# EAGLE design Game_Board (EAGLE 6.4)
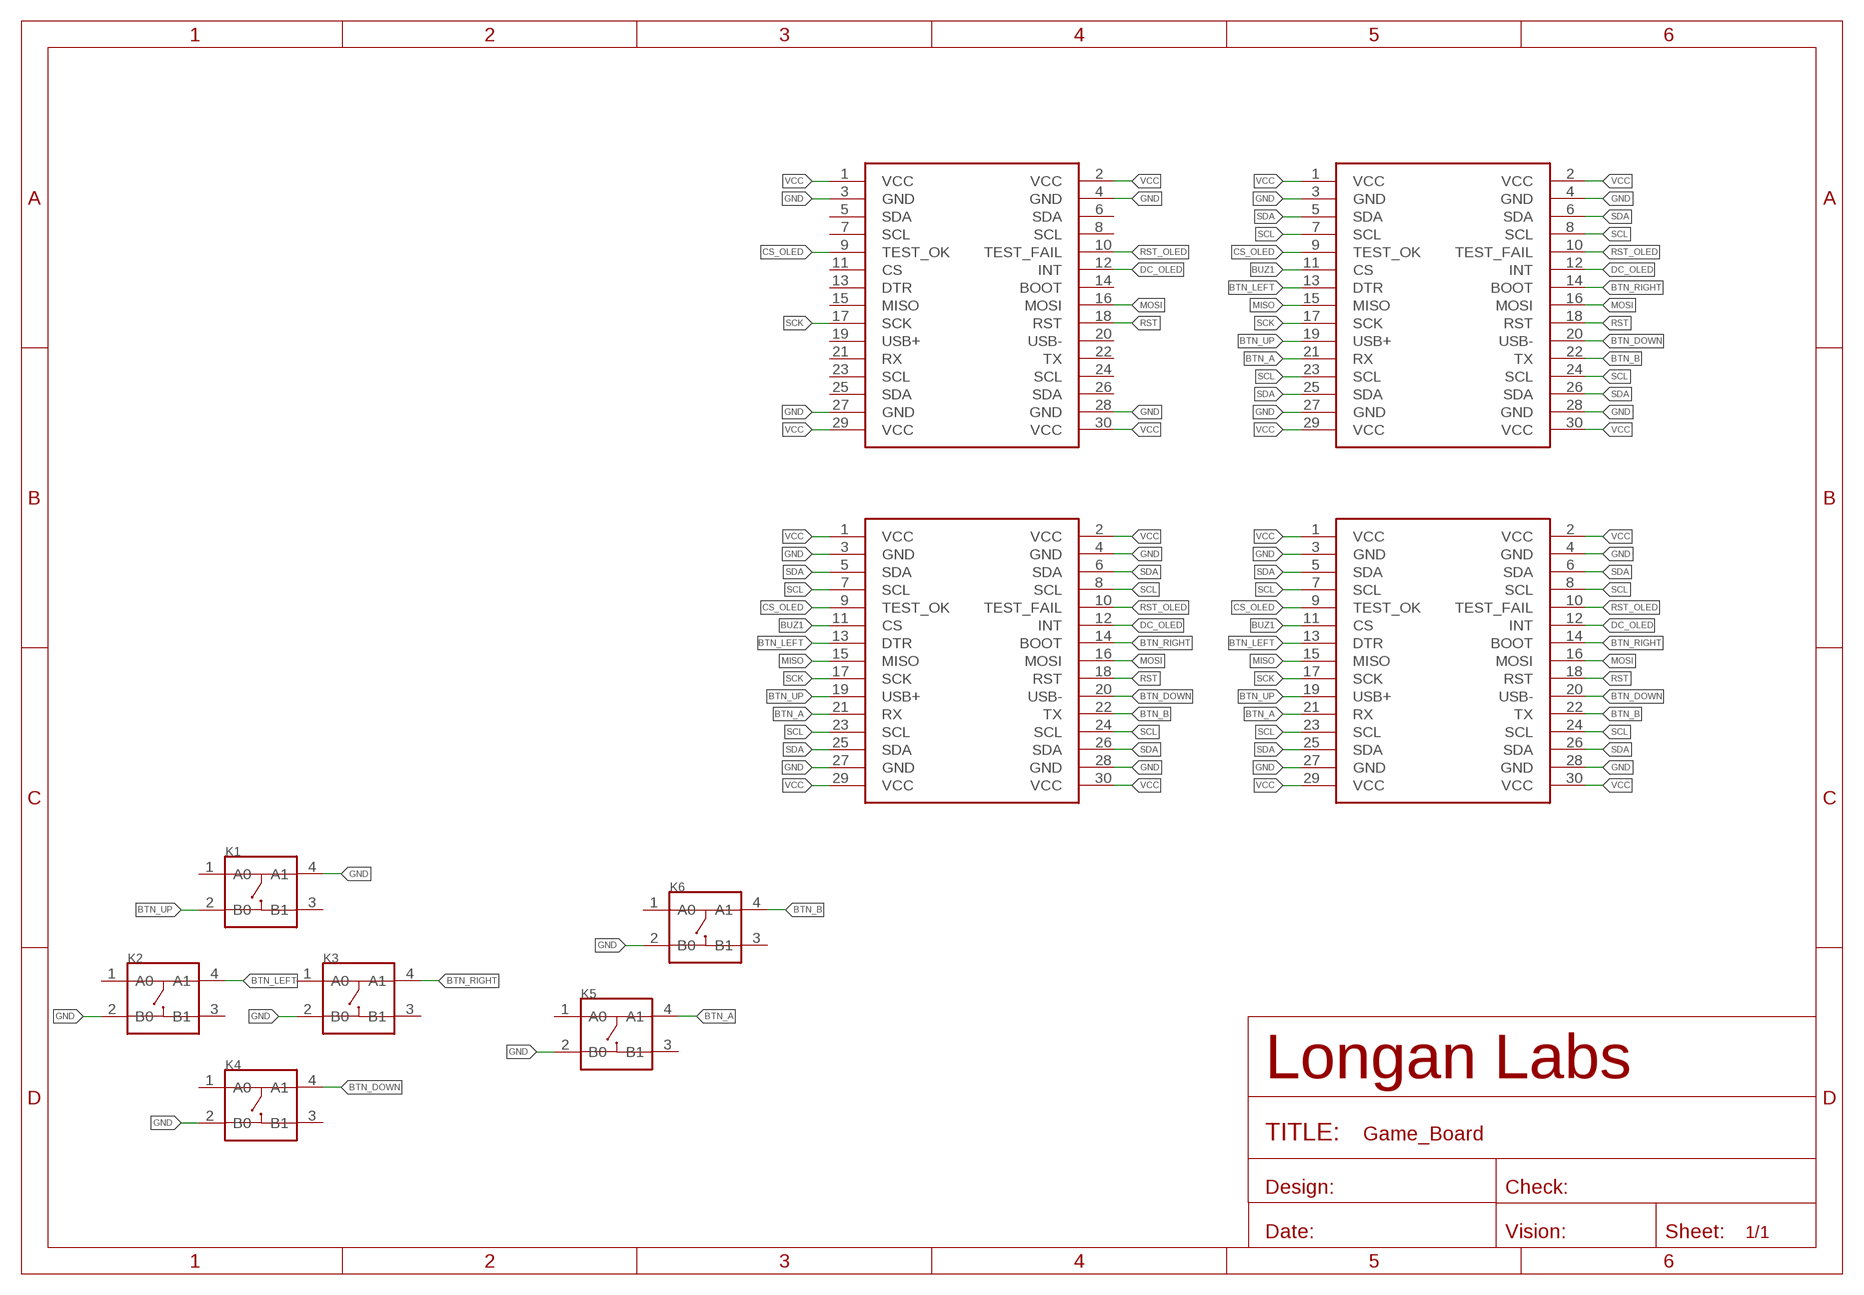
[diagram p0: schematic, sheet 1]

## Parts
K1  BUTTON-4PDTSM-62K-S-V-T/R(SN431)  [SW4-SMD-6.0X6.0X5.0MM]
K2  BUTTON-4PDTSM-62K-S-V-T/R(SN431)  [SW4-SMD-6.0X6.0X5.0MM]
K3  BUTTON-4PDTSM-62K-S-V-T/R(SN431)  [SW4-SMD-6.0X6.0X5.0MM]
K4  BUTTON-4PDTSM-62K-S-V-T/R(SN431)  [SW4-SMD-6.0X6.0X5.0MM]
K5  BUTTON-4PDTSM-62K-S-V-T/R(SN431)  [SW4-SMD-6.0X6.0X5.0MM]
K6  BUTTON-4PDTSM-62K-S-V-T/R(SN431)  [SW4-SMD-6.0X6.0X5.0MM]
MOUDLE1  MOUDLE-2X15P-2.54'2.54'  [2X15P-2.54]
MOUDLE2  MOUDLE-2X15P-2.54'2.54'  [2X15P-2.54]
MOUDLE3  MOUDLE-2X15P-2.54'90D'  [2X15P-2.54-90D]
MOUDLE4  MOUDLE-2X15P-2.54'2.54'  [2X15P-2.54]

## Nets
BTN_A: K5.4(A1) MOUDLE1.21(RX) MOUDLE2.21(RX) MOUDLE4.21(RX)
BTN_B: K6.4(A1) MOUDLE1.22(TX) MOUDLE2.22(TX) MOUDLE4.22(TX)
BTN_DOWN: K4.4(A1) MOUDLE1.20(USB-) MOUDLE2.20(USB-) MOUDLE4.20(USB-)
BTN_LEFT: K2.4(A1) MOUDLE1.13(DTR) MOUDLE2.13(DTR) MOUDLE4.13(DTR)
BTN_RIGHT: K3.4(A1) MOUDLE1.14(BOOT) MOUDLE2.14(BOOT) MOUDLE4.14(BOOT)
BTN_UP: K1.2(B0) MOUDLE1.19(USB+) MOUDLE2.19(USB+) MOUDLE4.19(USB+)
BUZ1: MOUDLE1.11(CS) MOUDLE2.11(CS) MOUDLE4.11(CS)
CS_OLED: MOUDLE1.9(TEST_OK) MOUDLE2.9(TEST_OK) MOUDLE3.9(TEST_OK) MOUDLE4.9(TEST_OK)
DC_OLED: MOUDLE1.12(INT) MOUDLE2.12(INT) MOUDLE3.12(INT) MOUDLE4.12(INT)
GND: K1.4(A1) K2.2(B0) K3.2(B0) K4.2(B0) K5.2(B0) K6.2(B0) MOUDLE1.3(GND) MOUDLE1.4(GND) MOUDLE1.27(GND) MOUDLE1.28(GND) MOUDLE2.3(GND) MOUDLE2.4(GND) MOUDLE2.27(GND) MOUDLE2.28(GND) MOUDLE3.3(GND) MOUDLE3.4(GND) MOUDLE3.27(GND) MOUDLE3.28(GND) MOUDLE4.3(GND) MOUDLE4.4(GND) MOUDLE4.27(GND) MOUDLE4.28(GND)
MISO: MOUDLE1.15(MISO) MOUDLE2.15(MISO) MOUDLE4.15(MISO)
MOSI: MOUDLE1.16(MOSI) MOUDLE2.16(MOSI) MOUDLE3.16(MOSI) MOUDLE4.16(MOSI)
RST: MOUDLE1.18(RST) MOUDLE2.18(RST) MOUDLE3.18(RST) MOUDLE4.18(RST)
RST_OLED: MOUDLE1.10(TEST_FAIL) MOUDLE2.10(TEST_FAIL) MOUDLE3.10(TEST_FAIL) MOUDLE4.10(TEST_FAIL)
SCK: MOUDLE1.17(SCK) MOUDLE2.17(SCK) MOUDLE3.17(SCK) MOUDLE4.17(SCK)
SCL: MOUDLE1.7(SCL) MOUDLE1.8(SCL) MOUDLE1.23(SCL) MOUDLE1.24(SCL) MOUDLE2.7(SCL) MOUDLE2.8(SCL) MOUDLE2.23(SCL) MOUDLE2.24(SCL) MOUDLE4.7(SCL) MOUDLE4.8(SCL) MOUDLE4.23(SCL) MOUDLE4.24(SCL)
SDA: MOUDLE1.5(SDA) MOUDLE1.6(SDA) MOUDLE1.25(SDA) MOUDLE1.26(SDA) MOUDLE2.5(SDA) MOUDLE2.6(SDA) MOUDLE2.25(SDA) MOUDLE2.26(SDA) MOUDLE4.5(SDA) MOUDLE4.6(SDA) MOUDLE4.25(SDA) MOUDLE4.26(SDA)
VCC: MOUDLE1.1(VCC) MOUDLE1.2(VCC) MOUDLE1.29(VCC) MOUDLE1.30(VCC) MOUDLE2.1(VCC) MOUDLE2.2(VCC) MOUDLE2.29(VCC) MOUDLE2.30(VCC) MOUDLE3.1(VCC) MOUDLE3.2(VCC) MOUDLE3.29(VCC) MOUDLE3.30(VCC) MOUDLE4.1(VCC) MOUDLE4.2(VCC) MOUDLE4.29(VCC) MOUDLE4.30(VCC)
Unconnected: K1.1(A0) K1.3(B1) K2.1(A0) K2.3(B1) K3.1(A0) K3.3(B1) K4.1(A0) K4.3(B1) K5.1(A0) K5.3(B1) K6.1(A0) K6.3(B1) MOUDLE3.5(SDA) MOUDLE3.6(SDA) MOUDLE3.7(SCL) MOUDLE3.8(SCL) MOUDLE3.11(CS) MOUDLE3.13(DTR) MOUDLE3.14(BOOT) MOUDLE3.15(MISO) MOUDLE3.19(USB+) MOUDLE3.20(USB-) MOUDLE3.21(RX) MOUDLE3.22(TX) MOUDLE3.23(SCL) MOUDLE3.24(SCL) MOUDLE3.25(SDA) MOUDLE3.26(SDA)

## Library data of the parts
K1-K6 = Discrete-new:BUTTON-4P: SW4-6.0X6.0X5.0MM:311020024;SW4-8.0X8.0X9.0MM:311020028;SW4-SMD-6.0X6.0X5.0MM:311020004;SW4-SMD-3.35X3.35X1.5MM:311020030;SW4-SMD-5.2X5.2X2.5MM:311020046
MOUDLE1-MOUDLE4 = Longan-moudle:MOUDLE-2X15P-2.54

## Net classes
0 default: width 0.152 mm, clearance 0.152 mm
2 gnd: width 0.152 mm, drill 0.152 mm, clearance 0.152 mm
3 usbvcc: width 0.152 mm, drill 0.152 mm, clearance 0.152 mm

## Board
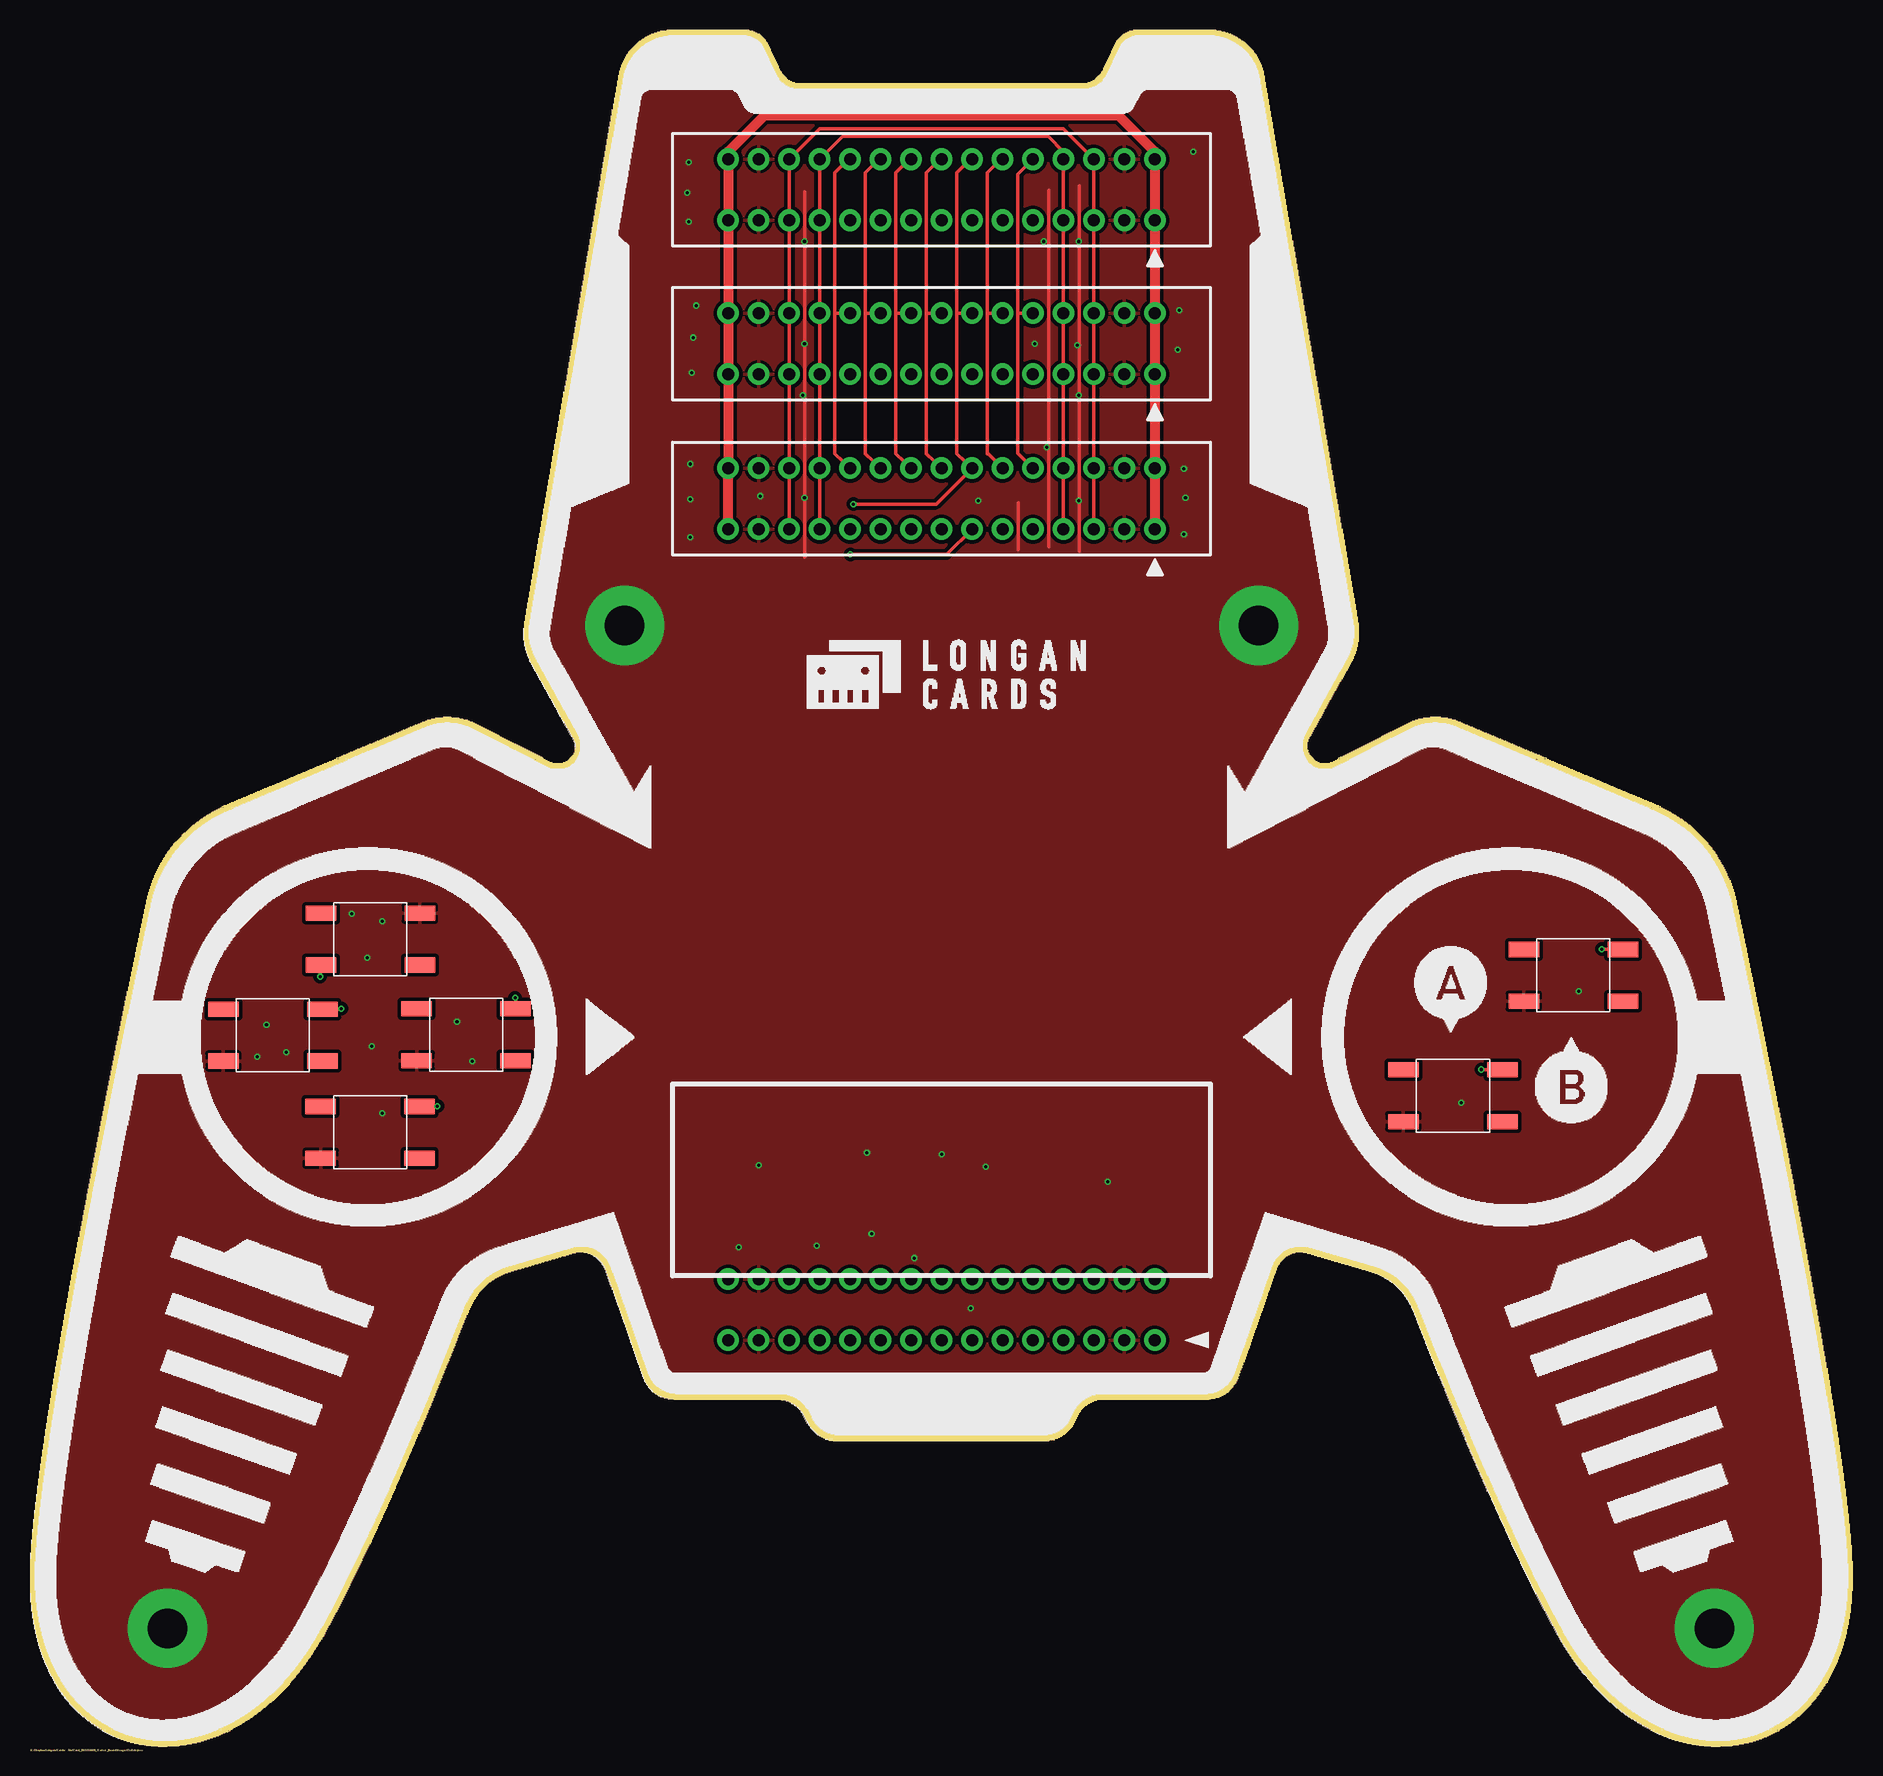
[diagram p1: board, top side]
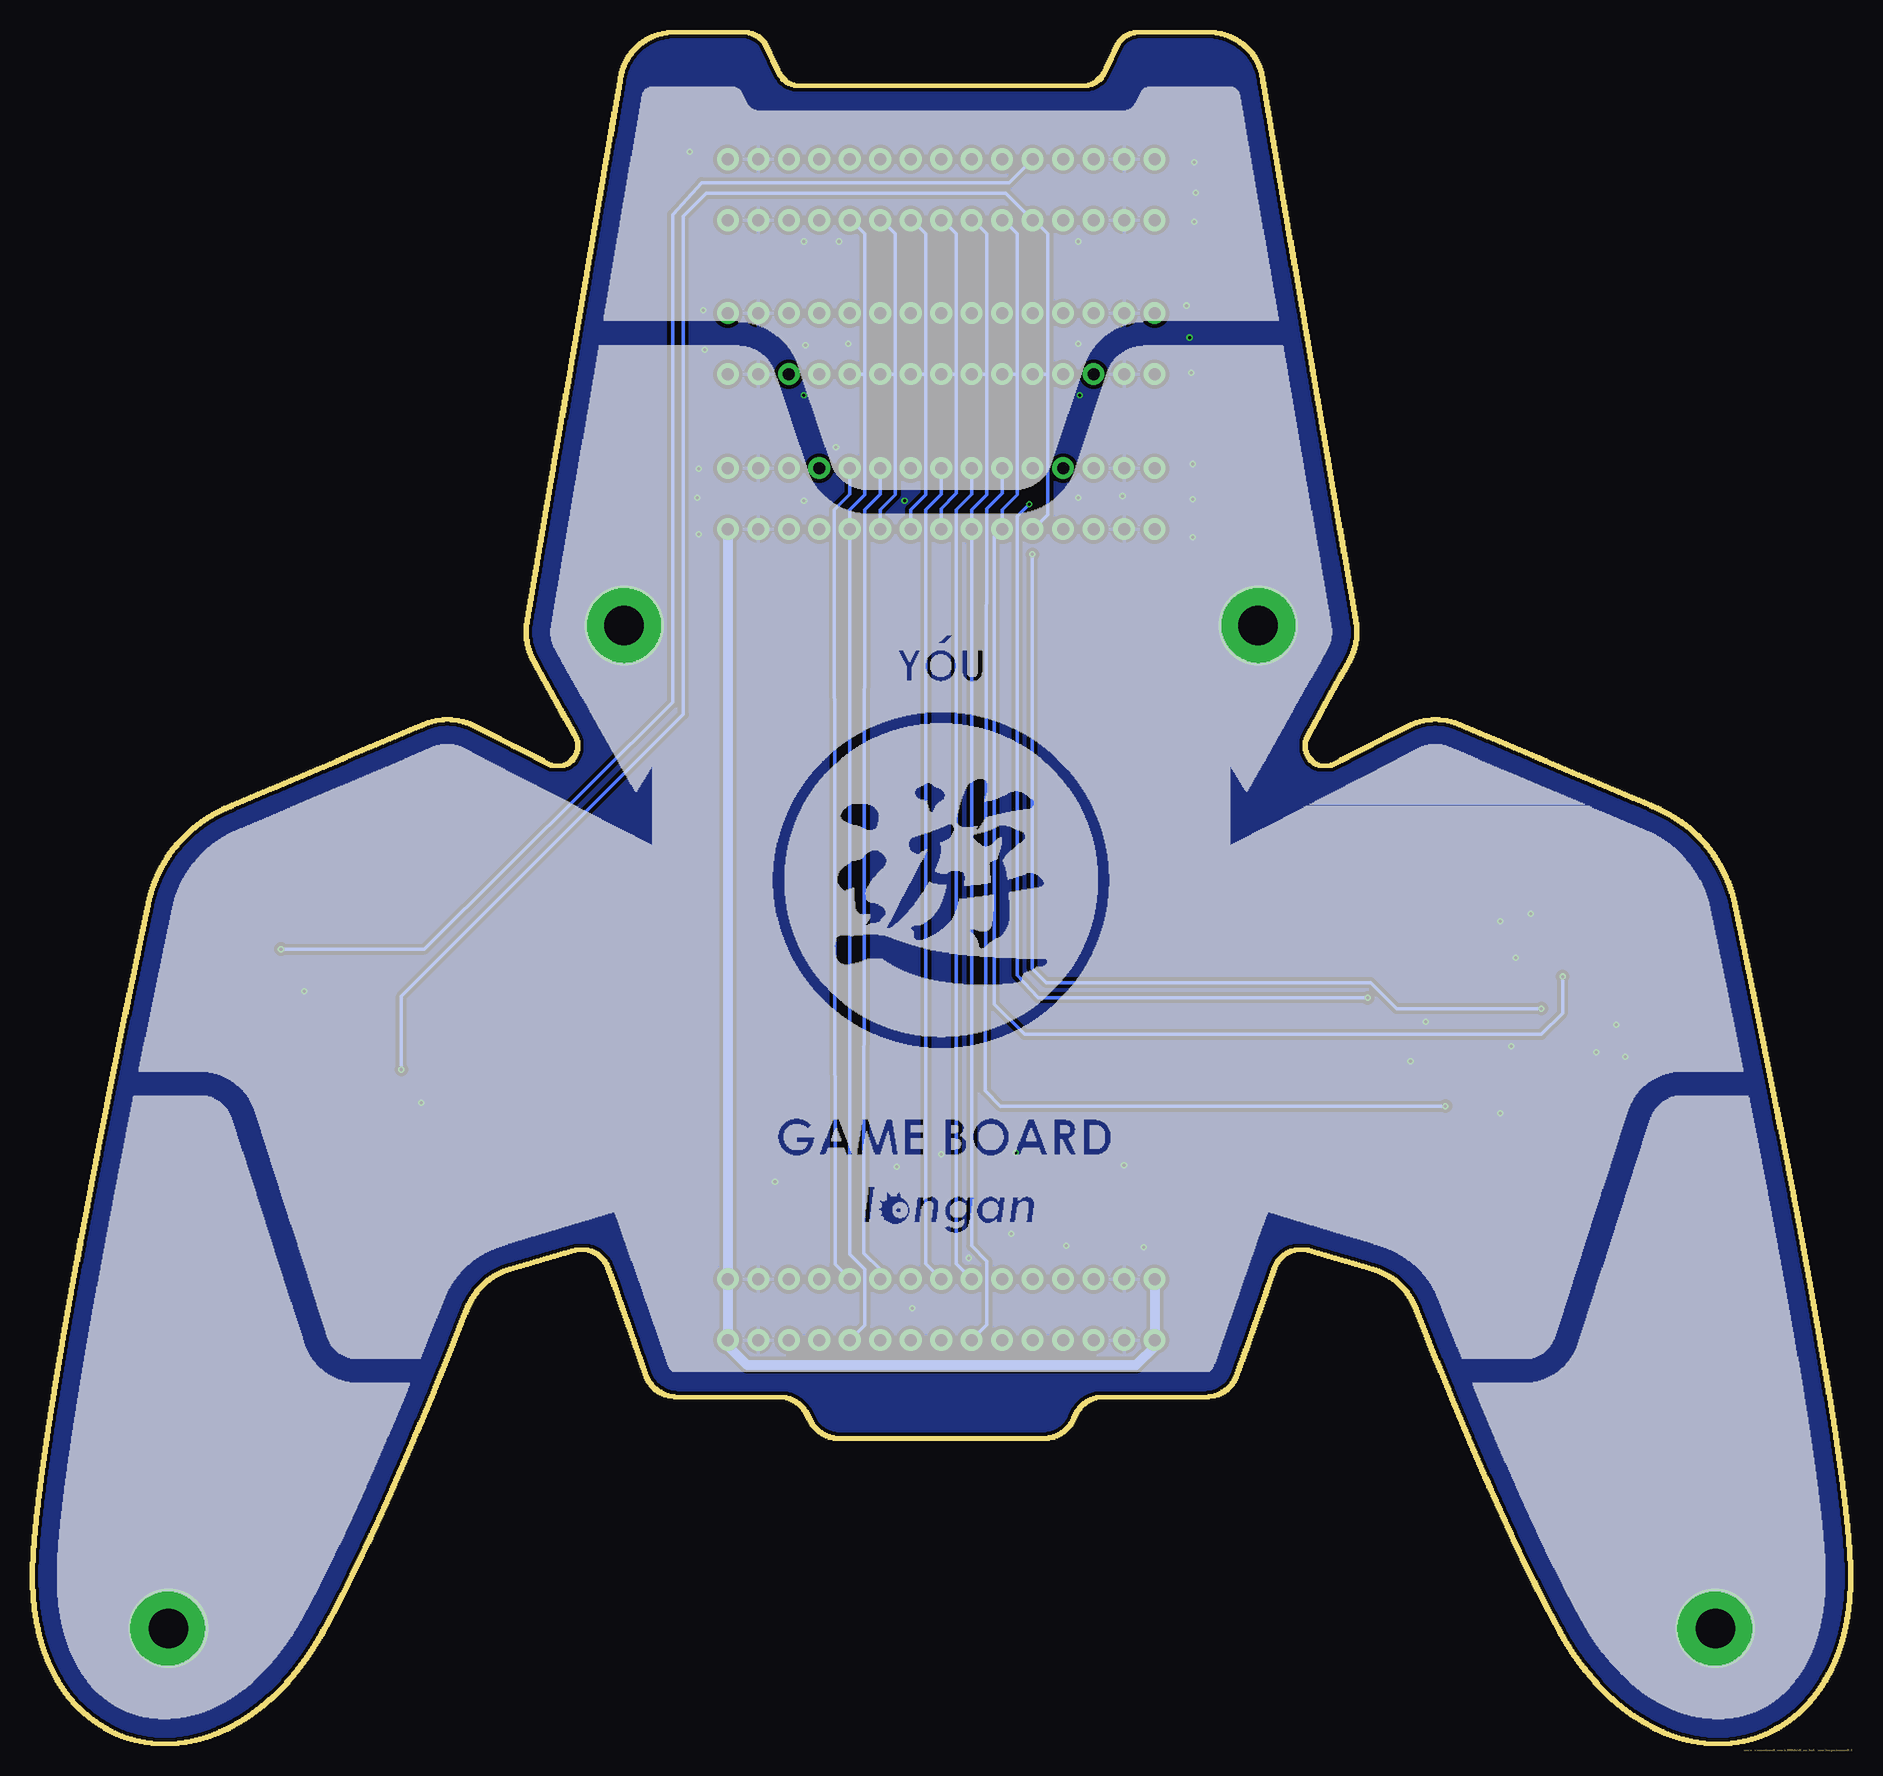
[diagram p2: board, bottom side, seen from below]

Size 151.9 x 142.97 mm. Coordinates in mm from the lower left corner, seen from the top.
Copper layers (1*16): Top 0.035mm / dielectric 1.5mm / Bottom 0.035mm
Design rules "SeeedStudio_2layer_DRU_no_angle_20140221": minimum track width 1mil, minimum drill 10mil, track to track 6mil, track to pad 6mil, pad to pad 6mil, via to via 6mil, smd to smd 0mil, copper to edge 10mil, drill to drill 10mil, minimum pad ring 4mil, minimum via ring 4mil, stop-mask expansion 2mil, vias tented up to drill 25mil, thermal gap 10mil

### Footprints (pad centres in the part's own frame; a part is rotated, then mirrored left to right if it is on the bottom)
SW4-SMD-6.0X6.0X5.0MM = smd 2.54 x 1.27: 1 -4.129,2.159; 2 -4.129,-2.159; 3 4.129,-2.159; 4 4.129,2.159
2X15P-2.54 = drill 1 pad 1.8: 1 -17.78,2.54; 2 -17.78,-2.54; 3 -15.24,2.54; 4 -15.24,-2.54; 5 -12.7,2.54; 6 -12.7,-2.54; 7 -10.16,2.54; 8 -10.16,-2.54; 9 -7.62,2.54; 10 -7.62,-2.54; 11 -5.08,2.54; 12 -5.08,-2.54; 13 -2.54,2.54; 14 -2.54,-2.54; 15 0,2.54; 16 0,-2.54; 17 2.54,2.54; 18 2.54,-2.54; 19 5.08,2.54; 20 5.08,-2.54; 21 7.62,2.54; 22 7.62,-2.54; 23 10.16,2.54; 24 10.16,-2.54; 25 12.7,2.54; 26 12.7,-2.54; 27 15.24,2.54; 28 15.24,-2.54; 29 17.78,2.54; 30 17.78,-2.54
2X15P-2.54-90D = drill 1 pad 1.8: 1 17.78,-13.335; 2 17.78,-8.255; 3 15.24,-13.335; 4 15.24,-8.255; 5 12.7,-13.335; 6 12.7,-8.255; 7 10.16,-13.335; 8 10.16,-8.255; 9 7.62,-13.335; 10 7.62,-8.255; 11 5.08,-13.335; 12 5.08,-8.255; 13 2.54,-13.335; 14 2.54,-8.255; 15 0,-13.335; 16 0,-8.255; 17 -2.54,-13.335; 18 -2.54,-8.255; 19 -5.08,-13.335; 20 -5.08,-8.255; 21 -7.62,-13.335; 22 -7.62,-8.255; 23 -10.16,-13.335; 24 -10.16,-8.255; 25 -12.7,-13.335; 26 -12.7,-8.255; 27 -15.24,-13.335; 28 -15.24,-8.255; 29 -17.78,-13.335; 30 -17.78,-8.255

### Placement (x,y rotation side)
K1  28.37,67.21 0 top
K2  20.24,59.21 0 top
K3  36.35,59.24 0 top
K4  28.34,51.11 0 top
K5  118.58,54.16 0 top
K6  128.61,64.19 0 top
MOUDLE1  75.96,129.66 180 top
MOUDLE2  75.96,116.83 180 top
MOUDLE3  75.96,47.14 0 top
MOUDLE4  75.96,103.92 180 top

### Tracks (layer width: path | path; a pad name or v marks a point on that pad's centre or on a via)
BTN_A  (via drill 0.25 pad 0.51)
  Top 0.305: K5.4 120.97,56.32 v120.95,56.35
  Bottom 0.305: 67.08,114.3 67.08,125.98 68.22,127.12 MOUDLE1.21 70.59,129.37 95.55,129.37 97.45,127.47 97.45,85.94 120.95,62.44 v120.95,56.35 | 67.08,114.3 67.08,102.58 MOUDLE4.21 | MOUDLE2.21 67.08,114.29 67.08,114.3
BTN_B  (via drill 0.25 pad 0.51)
  Top 0.305: MOUDLE1.22 68.22,132.2 67.08,131.06 67.08,119.5 | 67.08,119.5 67.08,107.66 MOUDLE4.22 | MOUDLE2.22 67.21,119.37 67.08,119.5 | K6.4 131,66.35 v130.98,66.38
  Bottom 0.305: v130.98,66.38 119.04,66.38 98.34,86.95 98.34,127.59 95.93,130.26 70.28,130.26 MOUDLE1.22
BTN_DOWN  (via drill 0.25 pad 0.51)
  Top 0.305: MOUDLE1.20 70.76,132.2 69.62,131.06 69.62,119.38 | 69.62,119.38 69.62,107.66 MOUDLE4.20 | MOUDLE2.20 69.62,119.37 69.62,119.38 | v33.95,53.3 32.5,53.3 K4.4
  Bottom 0.305: MOUDLE4.20 70.88,104.38 72.18,103.08 72.31,55.33 72.31,54.57 71.04,53.3 v33.95,53.3
BTN_LEFT  (via drill 0.25 pad 0.51)
  Top 0.305: K2.4 25.89,61.36 v25.95,61.43 | v68.37,99.27 76.4,99.27 MOUDLE4.13
  Bottom 0.305: MOUDLE1.13 78.38,127.12 77.24,125.98 77.24,114.3 | 77.24,114.3 77.24,104.26 78.5,103 MOUDLE4.13 | MOUDLE2.13 77.24,114.29 77.24,114.3 | v25.95,61.43 38.02,61.43 40.17,63.58 67.23,63.58 68.37,64.73 v68.37,99.27
BTN_RIGHT  (via drill 0.25 pad 0.51)
  Top 0.305: MOUDLE1.14 78.38,132.2 77.24,131.06 77.24,119.25 | 77.24,119.25 77.24,107.66 MOUDLE4.14 75.51,103.46 v68.62,103.46 | MOUDLE2.14 77.36,119.37 77.24,119.25 | K3.4 40.48,62.27 v40.43,62.31
  Bottom 0.305: v40.43,62.31 67.86,62.31 69.64,64.22 69.64,102.45 v68.62,103.46
BTN_UP  (via drill 0.25 pad 0.51)
  Top 0.305: v24.17,64.09 24.17,64.98 K1.2
  Bottom 0.305: MOUDLE1.19 70.76,127.12 69.62,125.98 69.62,114.42 | MOUDLE2.19 69.75,114.29 69.62,114.42 | 69.62,114.42 69.62,104.26 70.89,102.99 MOUDLE4.19 71.53,100.74 71.53,61.79 69,59.27 25.95,59.27 24.17,61.04 v24.17,64.09
BUZ1
  Bottom 0.305: MOUDLE1.11 80.92,127.12 79.78,125.98 79.78,114.3 | 79.78,114.3 79.78,104.26 81.04,103 MOUDLE4.11 | MOUDLE2.11 79.78,114.29 79.78,114.3
CS_OLED
  Bottom 0.305: MOUDLE1.9 83.46,127.12 82.32,125.98 82.32,114.3 | 82.32,114.3 82.32,104.26 83.58,103 MOUDLE4.9 83.58,40.95 82.34,39.71 82.34,35.05 MOUDLE3.9 | MOUDLE2.9 82.32,114.29 82.32,114.3
DC_OLED
  Top 0.305: MOUDLE1.12 80.92,132.2 79.78,131.06 79.78,119.38 | 79.78,119.38 79.78,107.66 79.84,107.66 MOUDLE4.12 | MOUDLE2.12 79.78,119.37 79.78,119.38
  Bottom 0.305: MOUDLE4.12 81.04,104.27 82.32,102.99 82.4,43.49 | 82.4,43.49 82.4,43.15 82.4,41.39 | 82.4,43.49 82.4,41.04 81.04,39.68 MOUDLE3.12
GND  (via drill 0.25 pad 0.51, 3.3 pad 6.6)
  Top 0.305: 32.82,69.05 K1.4 | 84.88,99.91 84.88,129.62 | 87.42,99.53 87.42,130.01 | 82.34,99.65 82.34,103.59 | 64.56,99.02 64.56,129.5
  other vias: 59.08,41.53 65.56,41.65 70.13,42.67 69.75,49.4 60.73,48.38 28.09,65.66 18.95,57.4 19.71,60.07 89.81,46.99 11.45,9.78 140.36,9.78 102.39,93.34 49.55,93.34 26.82,69.34 35.58,60.32 28.47,58.29 36.85,57.02 119.28,53.59 129.06,62.86 79.65,48.26 78.38,36.45 84.48,125.35 83.72,116.84 84.73,108.2 87.4,125.35 87.27,116.71 87.4,112.52 79.02,103.76 87.4,103.76 64.54,125.35 64.54,116.84 64.54,104.01 64.41,112.52 21.36,57.78 29.36,52.7 29.36,68.7 75.97,49.27 73.68,40.64 54.89,131.95 54.76,129.41 54.89,127 55.52,120.01 55.27,117.34 55.14,114.42 95.78,119.63 95.65,116.33 96.92,132.84 96.16,106.42 96.29,104.01 96.16,100.96 60.86,104.14 55.01,106.8 55.01,103.88 55.01,100.71
  pour Top (isolate 0.305): 169.42,-3.03 -18.79,-3.03 -19.05,144.29 170.82,144.67
  pour Bottom (isolate 0.305): 169.42,-3.03 -18.79,-3.03 -19.09,144.29 170.82,144.79
MISO
  Bottom 0.305: MOUDLE1.15 75.84,127.12 74.7,125.98 74.7,114.17 | 74.7,114.17 74.7,104.36 75.96,103.09 MOUDLE4.15 | MOUDLE2.15 74.82,114.29 74.7,114.17
MOSI
  Top 0.305: MOUDLE1.16 75.84,132.2 74.7,131.06 74.7,119.5 | 74.7,119.5 74.7,107.66 MOUDLE4.16 | MOUDLE2.16 74.83,119.37 74.7,119.5
  Bottom 0.305: MOUDLE4.16 75.96,104.27 77.24,102.99 77.24,40.16 MOUDLE3.16
RST
  Top 0.305: MOUDLE1.18 73.3,132.2 72.16,131.06 72.16,119.25 | 72.16,119.25 72.16,107.66 MOUDLE4.18 | MOUDLE2.18 72.28,119.37 72.16,119.25
  Bottom 0.305: MOUDLE4.18 73.42,104.27 74.7,102.99 74.7,40.16 MOUDLE3.18
RST_OLED
  Top 0.305: MOUDLE1.10 82.32,130.93 82.32,119.38 | 82.32,119.38 82.32,107.72 MOUDLE4.10 | MOUDLE2.10 82.32,119.37 82.32,119.38
  Bottom 0.305: MOUDLE4.10 83.58,104.27 84.86,102.99 84.8,40.1 MOUDLE3.10
SCK
  Bottom 0.305: MOUDLE1.17 73.3,127.12 72.16,125.98 72.16,117.22 | 72.16,117.22 72.16,104.26 73.42,103 MOUDLE4.17 73.43,41.65 72.16,40.38 72.16,35.07 MOUDLE3.17 | MOUDLE2.17 72.16,114.29 72.16,117.22
SCL
  Top 0.305: MOUDLE4.23 MOUDLE4.24 MOUDLE2.23 MOUDLE2.24 MOUDLE1.23 MOUDLE1.24 67.71,134.11 84.86,134.11 86.12,132.85 MOUDLE1.8 MOUDLE1.7 MOUDLE2.8 MOUDLE2.7 MOUDLE4.8 MOUDLE4.7
SDA
  Top 0.305: MOUDLE4.25 MOUDLE4.26 MOUDLE2.25 MOUDLE2.26 MOUDLE1.25 MOUDLE1.26 65.81,134.74 86.12,134.74 MOUDLE1.6 MOUDLE1.5 MOUDLE2.6 MOUDLE2.5 MOUDLE4.6 MOUDLE4.5
VCC
  Top 0.813: MOUDLE4.29 MOUDLE4.30 MOUDLE2.29 MOUDLE2.30 MOUDLE1.29 MOUDLE1.30 58.18,132.83 61.24,135.89 90.7,135.89 93.74,132.85 MOUDLE1.2 MOUDLE1.1 MOUDLE2.2 MOUDLE2.1 MOUDLE4.2 MOUDLE4.1
  Bottom 0.813: MOUDLE4.1 MOUDLE3.2 MOUDLE3.1 93.74,33.33 92.12,31.71 59.73,31.71 58.18,33.26 MOUDLE3.29 MOUDLE3.30

### Text on the board
Dimension: E:/Dropbox/Longan/Cards/ԭÀíͼ/Card_25/1016008_Game_Board/image/±߿ò.bmp
tPlace: E:/Dropbox/Longan/Cards/ԭÀíͼ/Card_25/1016008_Game_Board/image/ÕýÃæ.bmp